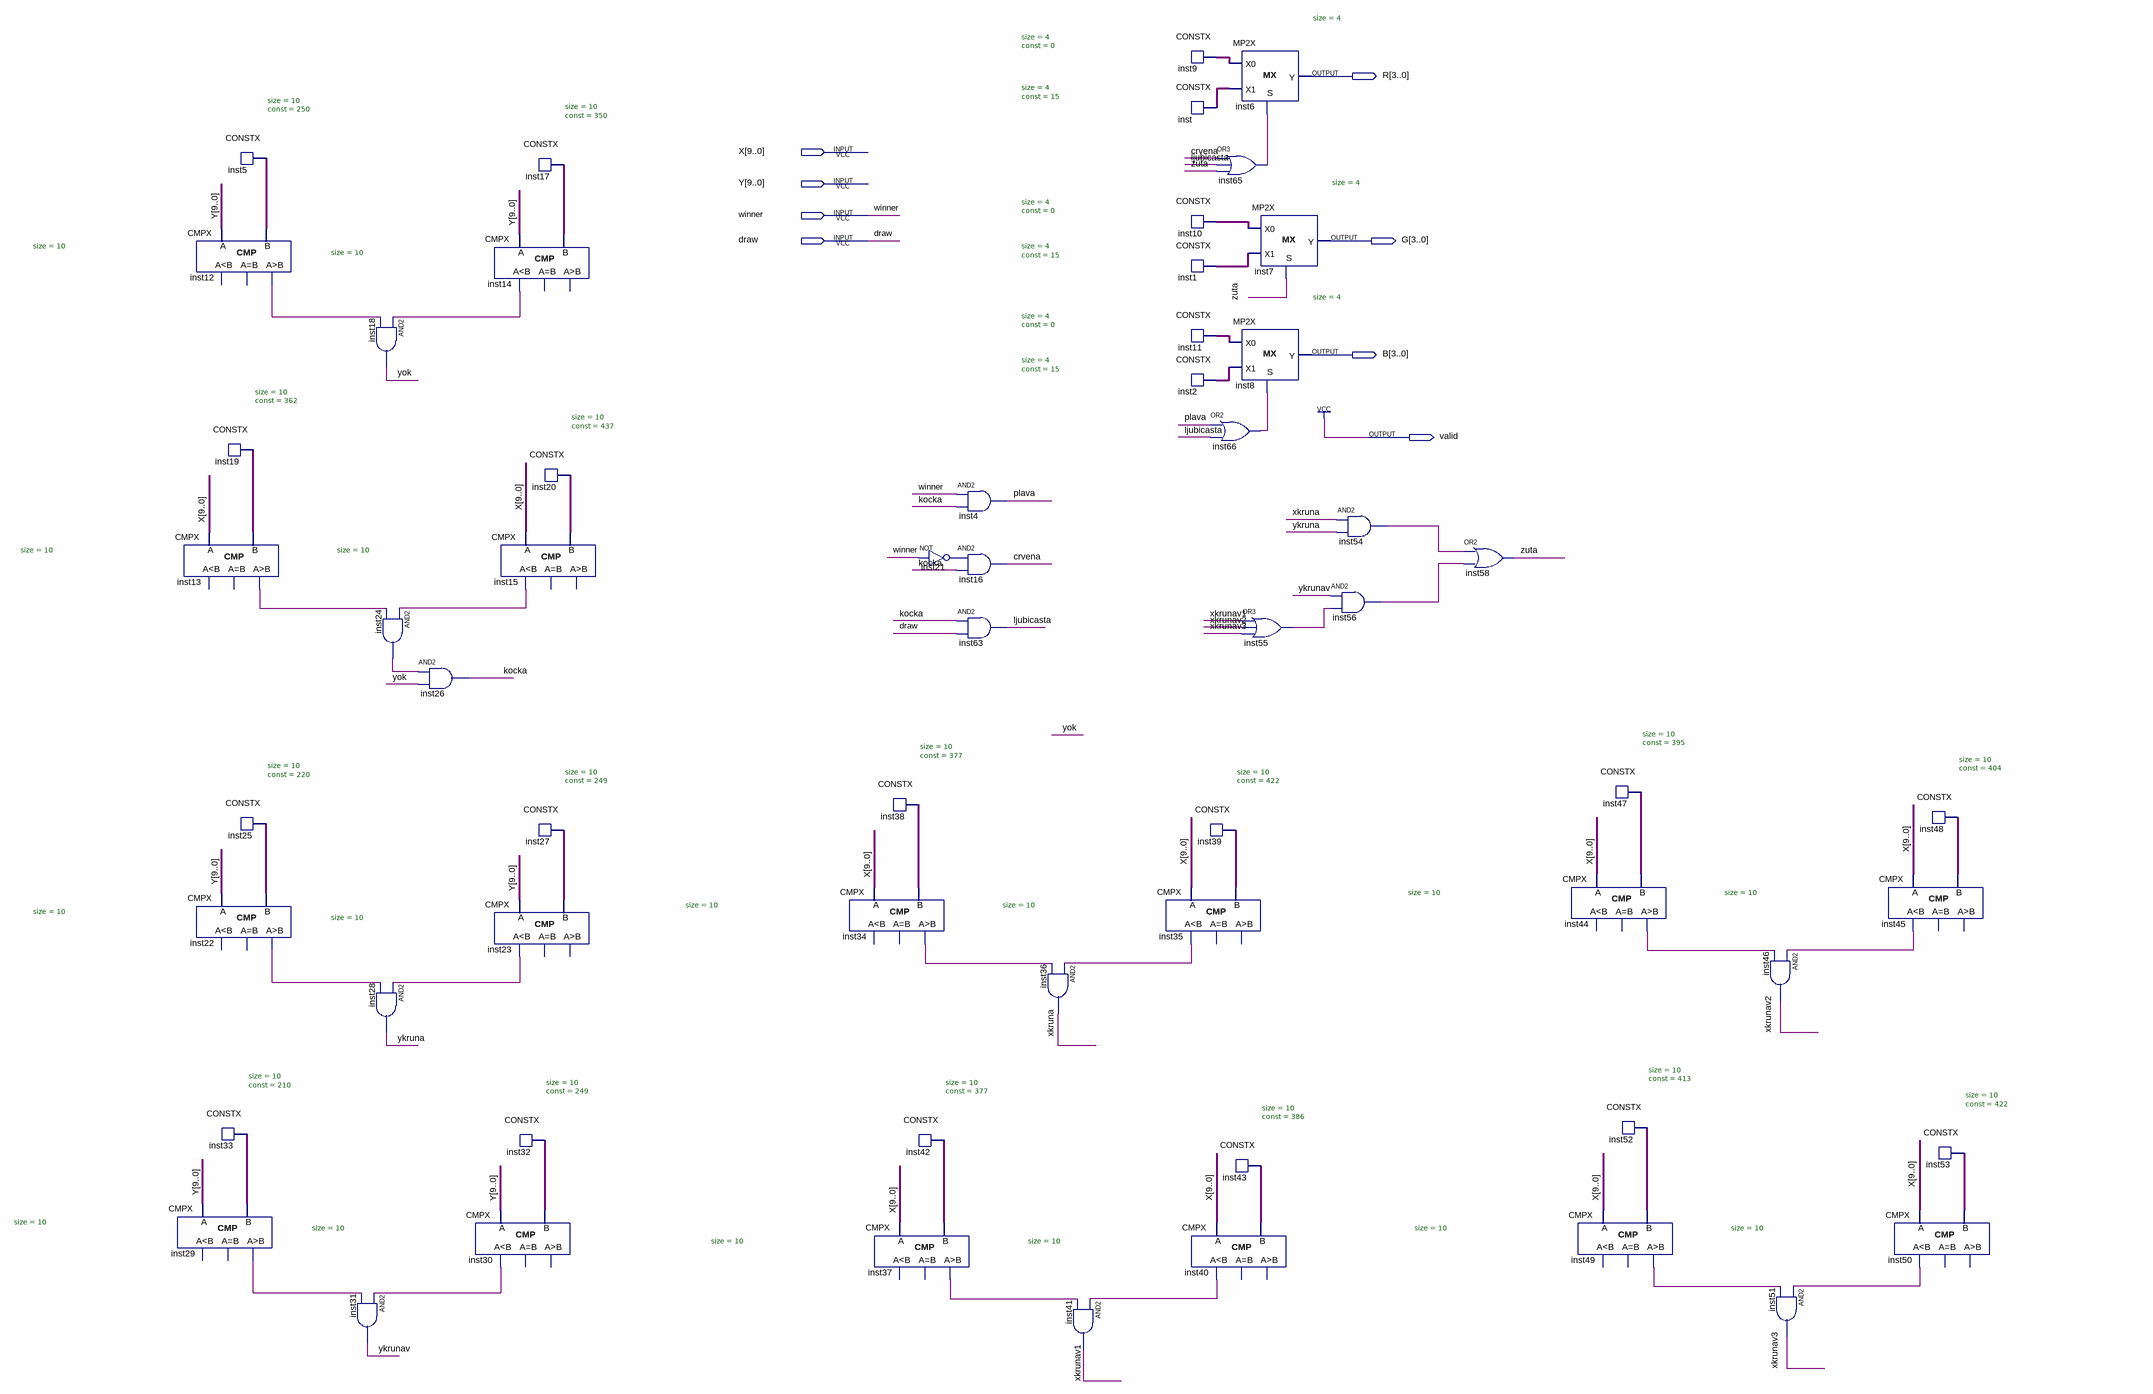
[diagram p0: schematic sheet]
// Quartus schematic Endgame.bdf as structural Verilog: 60 symbols, 8 pins
module Endgame (
  input  [9:0] X,
  input  [9:0] Y,
  input  winner,
  input  draw,
  output [3:0] R,
  output [3:0] G,
  output [3:0] B,
  output valid
);

  wire crvena, inst12_gr, inst13_gr, inst14_ls, inst15_ls, inst21_out, inst22_gr, inst23_ls, inst24_out,
       inst29_gr, inst30_ls, inst34_gr, inst35_ls, inst37_gr, inst40_ls, inst44_gr, inst45_ls, inst49_gr,
       inst50_ls, inst54_out, inst55_out, inst56_out, inst65_out, inst66_out, kocka, ljubicasta, plava,
       xkruna, xkrunav1, xkrunav2, xkrunav3, ykruna, ykrunav, yok, zuta;
  wire [3:0] inst1_data, inst2_data, inst9_data, inst10_data, inst11_data, inst_data;
  wire [9:0] inst5_data, inst17_data, inst19_data, inst20_data, inst25_data, inst27_data, inst32_data,
       inst33_data, inst38_data, inst39_data, inst42_data, inst43_data, inst47_data, inst48_data,
       inst52_data, inst53_data;

  CMPX #(.size(10)) inst29 (.A(Y), .B(inst33_data), .gr(inst29_gr));  // open: ls, eq
  CMPX #(.size(10)) inst12 (.A(Y), .B(inst5_data), .gr(inst12_gr));  // open: ls, eq
  CONSTX #(.size(10), .\const (362)) inst19 (.data(inst19_data));
  CMPX #(.size(10)) inst13 (.A(X), .B(inst19_data), .gr(inst13_gr));  // open: ls, eq
  CMPX #(.size(10)) inst22 (.A(Y), .B(inst25_data), .gr(inst22_gr));  // open: ls, eq
  CONSTX #(.size(10), .\const (210)) inst33 (.data(inst33_data));
  CONSTX #(.size(10), .\const (250)) inst5 (.data(inst5_data));
  CONSTX #(.size(10), .\const (220)) inst25 (.data(inst25_data));
  and inst18 (yok, inst14_ls, inst12_gr);
  and inst28 (ykruna, inst23_ls, inst22_gr);
  and inst31 (ykrunav, inst30_ls, inst29_gr);
  and inst24 (inst24_out, inst15_ls, inst13_gr);
  and inst26 (kocka, inst24_out, yok);
  CMPX #(.size(10)) inst30 (.A(Y), .B(inst32_data), .ls(inst30_ls));  // open: eq, gr
  CONSTX #(.size(10), .\const (350)) inst17 (.data(inst17_data));
  CMPX #(.size(10)) inst14 (.A(Y), .B(inst17_data), .ls(inst14_ls));  // open: eq, gr
  CMPX #(.size(10)) inst15 (.A(X), .B(inst20_data), .ls(inst15_ls));  // open: eq, gr
  CONSTX #(.size(10), .\const (249)) inst27 (.data(inst27_data));
  CMPX #(.size(10)) inst23 (.A(Y), .B(inst27_data), .ls(inst23_ls));  // open: eq, gr
  CONSTX #(.size(10), .\const (249)) inst32 (.data(inst32_data));
  CONSTX #(.size(10), .\const (437)) inst20 (.data(inst20_data));
  CONSTX #(.size(10), .\const (377)) inst38 (.data(inst38_data));
  CMPX #(.size(10)) inst34 (.A(X), .B(inst38_data), .gr(inst34_gr));  // open: ls, eq
  CMPX #(.size(10)) inst37 (.A(X), .B(inst42_data), .gr(inst37_gr));  // open: ls, eq
  not inst21 (inst21_out, winner);
  CONSTX #(.size(10), .\const (377)) inst42 (.data(inst42_data));
  and inst4 (plava, winner, kocka);
  and inst16 (crvena, inst21_out, kocka);
  and inst63 (ljubicasta, kocka, draw);
  and inst36 (xkruna, inst35_ls, inst34_gr);
  and inst41 (xkrunav1, inst40_ls, inst37_gr);
  CONSTX #(.size(4), .\const (0)) inst9 (.data(inst9_data));
  CONSTX #(.size(4), .\const (15)) inst (.data(inst_data));
  CONSTX #(.size(4), .\const (0)) inst10 (.data(inst10_data));
  CONSTX #(.size(4), .\const (15)) inst1 (.data(inst1_data));
  CONSTX #(.size(4), .\const (0)) inst11 (.data(inst11_data));
  CONSTX #(.size(4), .\const (15)) inst2 (.data(inst2_data));
  CMPX #(.size(10)) inst35 (.A(X), .B(inst39_data), .ls(inst35_ls));  // open: eq, gr
  CMPX #(.size(10)) inst40 (.A(X), .B(inst43_data), .ls(inst40_ls));  // open: eq, gr
  MP2X #(.size(4)) inst6 (.S(inst65_out), .X0(inst9_data), .X1(inst_data), .Y(R));
  or inst65 (inst65_out, crvena, ljubicasta, zuta);
  MP2X #(.size(4)) inst8 (.S(inst66_out), .X0(inst11_data), .X1(inst2_data), .Y(B));
  or inst66 (inst66_out, plava, ljubicasta);
  CONSTX #(.size(10), .\const (422)) inst39 (.data(inst39_data));
  CONSTX #(.size(10), .\const (386)) inst43 (.data(inst43_data));
  MP2X #(.size(4)) inst7 (.S(zuta), .X0(inst10_data), .X1(inst1_data), .Y(G));
  or inst55 (inst55_out, xkrunav1, xkrunav2, xkrunav3);
  and inst56 (inst56_out, ykrunav, inst55_out);
  and inst54 (inst54_out, xkruna, ykruna);
  or inst58 (zuta, inst54_out, inst56_out);
  CMPX #(.size(10)) inst44 (.A(X), .B(inst47_data), .gr(inst44_gr));  // open: ls, eq
  CMPX #(.size(10)) inst49 (.A(X), .B(inst52_data), .gr(inst49_gr));  // open: ls, eq
  CONSTX #(.size(10), .\const (395)) inst47 (.data(inst47_data));
  CONSTX #(.size(10), .\const (413)) inst52 (.data(inst52_data));
  and inst46 (xkrunav2, inst45_ls, inst44_gr);
  and inst51 (xkrunav3, inst50_ls, inst49_gr);
  CMPX #(.size(10)) inst45 (.A(X), .B(inst48_data), .ls(inst45_ls));  // open: eq, gr
  CMPX #(.size(10)) inst50 (.A(X), .B(inst53_data), .ls(inst50_ls));  // open: eq, gr
  CONSTX #(.size(10), .\const (404)) inst48 (.data(inst48_data));
  CONSTX #(.size(10), .\const (422)) inst53 (.data(inst53_data));

  assign valid = 1'b1;
endmodule
